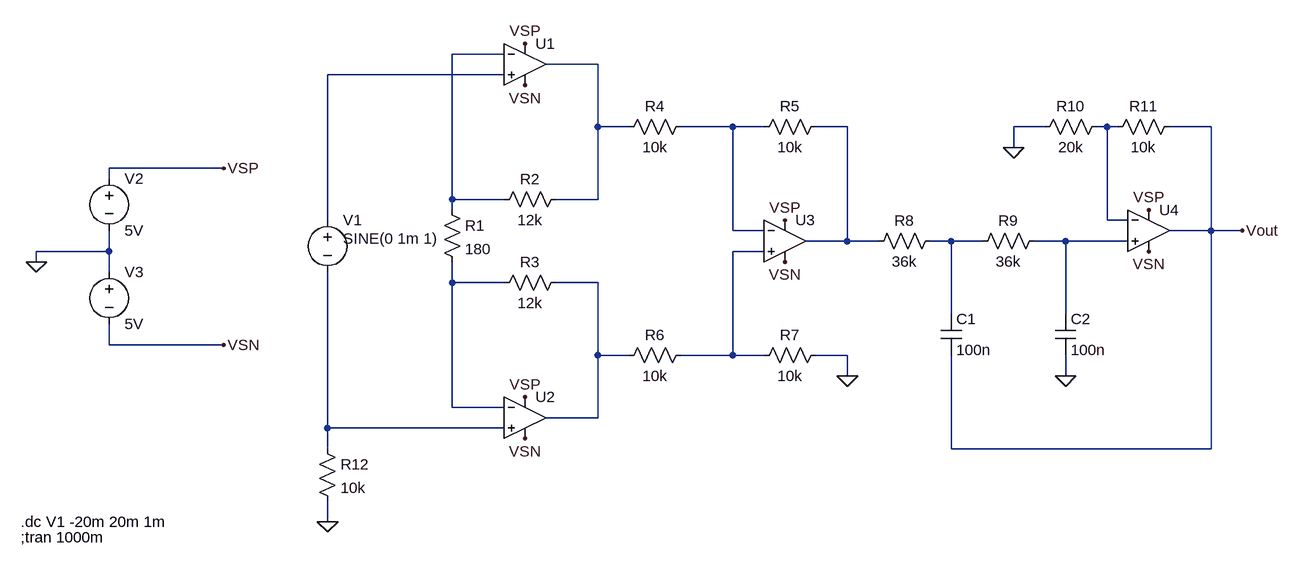
[diagram p0: schematic Anexa2.asm.asc]
Anexa2.asm.asc, the LTspice schematic file:
Version 4
SHEET 1 1640 680
WIRE 432 -240 352 -240
WIRE 576 -224 496 -224
WIRE 432 -208 160 -208
WIRE 576 -128 576 -224
WIRE 624 -128 576 -128
WIRE 784 -128 704 -128
WIRE 832 -128 784 -128
WIRE 960 -128 912 -128
WIRE 1264 -128 1216 -128
WIRE 1360 -128 1344 -128
WIRE 1376 -128 1360 -128
WIRE 1520 -128 1456 -128
WIRE 1216 -96 1216 -128
WIRE 0 -64 -176 -64
WIRE -176 -48 -176 -64
WIRE 352 -16 352 -240
WIRE 432 -16 352 -16
WIRE 576 -16 576 -128
WIRE 576 -16 512 -16
WIRE 352 0 352 -16
WIRE 160 16 160 -208
WIRE 1360 16 1360 -128
WIRE 1392 16 1360 16
WIRE 784 32 784 -128
WIRE 832 32 784 32
WIRE 1520 32 1520 -128
WIRE 1520 32 1456 32
WIRE 1568 32 1520 32
WIRE 960 48 960 -128
WIRE 960 48 896 48
WIRE 1008 48 960 48
WIRE 1120 48 1088 48
WIRE 1168 48 1120 48
WIRE 1296 48 1248 48
WIRE 1392 48 1296 48
WIRE -176 64 -176 32
WIRE -176 64 -288 64
WIRE 832 64 784 64
WIRE -288 80 -288 64
WIRE -176 96 -176 64
WIRE 352 112 352 80
WIRE 432 112 352 112
WIRE 576 112 512 112
WIRE 1120 160 1120 48
WIRE 1296 160 1296 48
WIRE -176 208 -176 176
WIRE 0 208 -176 208
WIRE 576 224 576 112
WIRE 624 224 576 224
WIRE 784 224 784 64
WIRE 784 224 704 224
WIRE 832 224 784 224
WIRE 960 224 912 224
WIRE 960 256 960 224
WIRE 1296 256 1296 224
WIRE 352 304 352 112
WIRE 432 304 352 304
WIRE 576 320 576 224
WIRE 576 320 496 320
WIRE 160 336 160 96
WIRE 432 336 160 336
WIRE 160 368 160 336
WIRE 1120 368 1120 224
WIRE 1520 368 1520 32
WIRE 1520 368 1120 368
WIRE 160 480 160 448
FLAG -288 80 0
FLAG 960 256 0
FLAG 1216 -96 0
FLAG 1296 256 0
FLAG 0 -64 VSP
FLAG 464 -256 VSP
FLAG 464 288 VSP
FLAG 864 16 VSP
FLAG 1424 0 VSP
FLAG 1424 64 VSN
FLAG 864 80 VSN
FLAG 464 352 VSN
FLAG 464 -192 VSN
FLAG 0 208 VSN
FLAG 1568 32 Vout
FLAG 160 480 0
SYMBOL voltage -176 -64 R0
WINDOW 123 0 0 Left 0
WINDOW 39 0 0 Left 0
SYMATTR InstName V2
SYMATTR Value 5V
SYMBOL voltage -176 80 R0
WINDOW 123 0 0 Left 0
WINDOW 39 0 0 Left 0
SYMATTR InstName V3
SYMATTR Value 5V
SYMBOL voltage 160 0 R0
WINDOW 123 24 124 Left 2
WINDOW 39 0 0 Left 0
WINDOW 3 24 44 Left 2
SYMATTR InstName V1
SYMATTR Value SINE(0 1m 1)
SYMBOL Opamps\\UniversalOpamp2 464 -224 R0
SYMATTR InstName U1
SYMBOL Opamps\\UniversalOpamp2 464 320 R0
SYMATTR InstName U2
SYMBOL res 336 -16 R0
SYMATTR InstName R1
SYMATTR Value 180
SYMBOL res 528 -32 R90
WINDOW 0 0 56 VBottom 2
WINDOW 3 32 56 VTop 2
SYMATTR InstName R2
SYMATTR Value 12k
SYMBOL res 528 96 R90
WINDOW 0 0 56 VBottom 2
WINDOW 3 32 56 VTop 2
SYMATTR InstName R3
SYMATTR Value 12k
SYMBOL res 720 -144 R90
WINDOW 0 0 56 VBottom 2
WINDOW 3 32 56 VTop 2
SYMATTR InstName R4
SYMATTR Value 10k
SYMBOL res 928 -144 R90
WINDOW 0 0 56 VBottom 2
WINDOW 3 32 56 VTop 2
SYMATTR InstName R5
SYMATTR Value 10k
SYMBOL res 720 208 R90
WINDOW 0 0 56 VBottom 2
WINDOW 3 32 56 VTop 2
SYMATTR InstName R6
SYMATTR Value 10k
SYMBOL res 928 208 R90
WINDOW 0 0 56 VBottom 2
WINDOW 3 32 56 VTop 2
SYMATTR InstName R7
SYMATTR Value 10k
SYMBOL Opamps\\UniversalOpamp2 864 48 R0
SYMATTR InstName U3
SYMBOL res 1104 32 R90
WINDOW 0 0 56 VBottom 2
WINDOW 3 32 56 VTop 2
SYMATTR InstName R8
SYMATTR Value 36k
SYMBOL res 1264 32 R90
WINDOW 0 0 56 VBottom 2
WINDOW 3 32 56 VTop 2
SYMATTR InstName R9
SYMATTR Value 36k
SYMBOL cap 1104 160 R0
SYMATTR InstName C1
SYMATTR Value 100n
SYMBOL cap 1280 160 R0
SYMATTR InstName C2
SYMATTR Value 100n
SYMBOL Opamps\\UniversalOpamp2 1424 32 R0
SYMATTR InstName U4
SYMBOL res 1360 -144 R90
WINDOW 0 0 56 VBottom 2
WINDOW 3 32 56 VTop 2
SYMATTR InstName R10
SYMATTR Value 20k
SYMBOL res 1472 -144 R90
WINDOW 0 0 56 VBottom 2
WINDOW 3 32 56 VTop 2
SYMATTR InstName R11
SYMATTR Value 10k
SYMBOL res 144 352 R0
SYMATTR InstName R12
SYMATTR Value 10k
TEXT -312 504 Left 2 !;tran 1000m
TEXT -312 480 Left 2 !.dc V1 -20m 20m 1m

The netlist it stands for:
* Anexa2.asm.asc
V2 VSP 0 5V
V3 0 VSN 5V
V1 N003 N012 SINE(0 1m 1)
XU1 N003 N001 VSP VSN N002 level.2 Avol=1Meg GBW=10Meg Slew=10Meg ilimit=25m rail=0 Vos=0 phimargin=45 en=0 enk=0 in=0 ink=0 Rin=500Meg  ; pins IN+ IN- V+ V- OUT
XU2 N012 N010 VSP VSN N011 level.2 Avol=1Meg GBW=10Meg Slew=10Meg ilimit=25m rail=0 Vos=0 phimargin=45 en=0 enk=0 in=0 ink=0 Rin=500Meg  ; pins IN+ IN- V+ V- OUT
R1 N001 N010 180
R2 N002 N001 12k
R3 N011 N010 12k
R4 N004 N002 10k
R5 N005 N004 10k
R6 N009 N011 10k
R7 0 N009 10k
XU3 N009 N004 VSP VSN N005 level.2 Avol=1Meg GBW=10Meg Slew=10Meg ilimit=25m rail=0 Vos=0 phimargin=45 en=0 enk=0 in=0 ink=0 Rin=500Meg  ; pins IN+ IN- V+ V- OUT
R8 N007 N005 36k
R9 N008 N007 36k
C1 N007 Vout 100n
C2 N008 0 100n
XU4 N008 N006 VSP VSN Vout level.2 Avol=1Meg GBW=10Meg Slew=10Meg ilimit=25m rail=0 Vos=0 phimargin=45 en=0 enk=0 in=0 ink=0 Rin=500Meg  ; pins IN+ IN- V+ V- OUT
R10 N006 0 20k
R11 Vout N006 10k
R12 N012 0 10k
;tran 1000m
.dc V1 -20m 20m 1m
.lib UniversalOpamps2.sub
.backanno
.end